# EAGLE schematic power-dc_rev_1 (EAGLE 6.3)
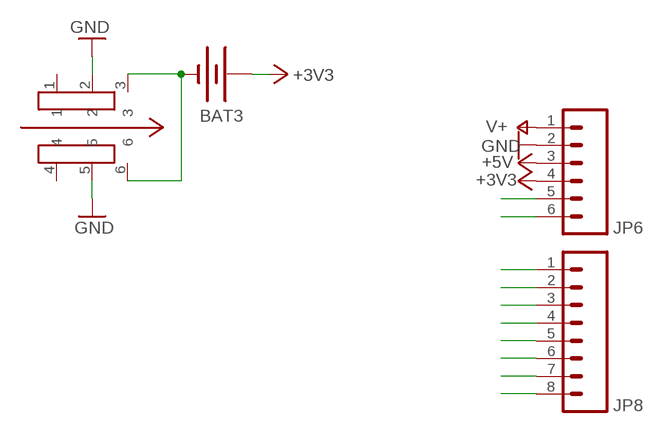
[diagram p0: schematic, sheet 1]

## Parts
BAT3  BATTERY20PTH  [BATTCOM_20MM_PTH]
JP6  6  M06SIP  [1X06]
JP8  8  M081X08  [1X08]
U$1  SWITCH  [SWITCH]

## Nets
+3V3: BAT3.1(+) JP6.4
+5V: JP6.3
AREF_D0: JP8.8
D1: JP8.7
D2: JP8.6
D3: JP8.5
D5: JP8.3
D7: JP8.1
D8: JP6.5
D9: JP6.6
GND: JP6.2 U$1.2 U$1.5
N$1: BAT3.2(-) U$1.3 U$1.6
SCL_D4: JP8.4
SDA_D6: JP8.2
V+: JP6.1
Unconnected: U$1.1 U$1.4

## Library data of the parts
BAT3 = SparkFun_mod:BATTERY: Battery Holders Various common sizes : AA, AAA, 20mm coin cell and 12mm coin cell.
JP6 = SparkFun:M06: Header 6 Standard 6-pin 0.1" header. Use with straight break away headers (SKU : PRT-00116), right angle break away headers (PRT-00553), swiss pins (PRT-00743), machine pins (PRT-00117), and female headers (PRT-00115). Molex polarized connector foot print use with SKU : PRT-08094 with associated crimp pins and housings. NOTES ON THE VARIANTS LOCK and LOCK_LONGPADS... This footprint was designed to help hold the alignment of a through-hole component (i.e. 6-pin header) while soldering it into place. You may notice that each hole has been shifted either up or down by 0.005 of an inch from it's more standard position (which is a perfectly straight line). This slight alteration caused the pins (the squares in the middle) to touch the edges of the holes. Because they are alternating, it causes a "brace" to hold the component in place. 0.005 has proven to be the perfect amount of "off-center" position when using our standard breakaway headers. Although looks a little odd when you look at the bare footprint, once you have a header in there, the alteration is very hard to notice. Also, if you push a header all the way into place, it is covered up entirely on the bottom side. This idea of altering the position of holes to aid alignment will be further integrated into the Sparkfun Library for other footprints. It can help hold any component with 3 or more connection pins.
JP8 = SparkFun:M08: Header 8 Standard 8-pin 0.1" header. Use with straight break away headers (SKU : PRT-00116), right angle break away headers (PRT-00553), swiss pins (PRT-00743), machine pins (PRT-00117), and female headers (PRT-00115).
U$1 = _my-parts:SWITCH: JS202011AQN DPDT